# Altium schematic sheet currentSense.SchDoc
size A
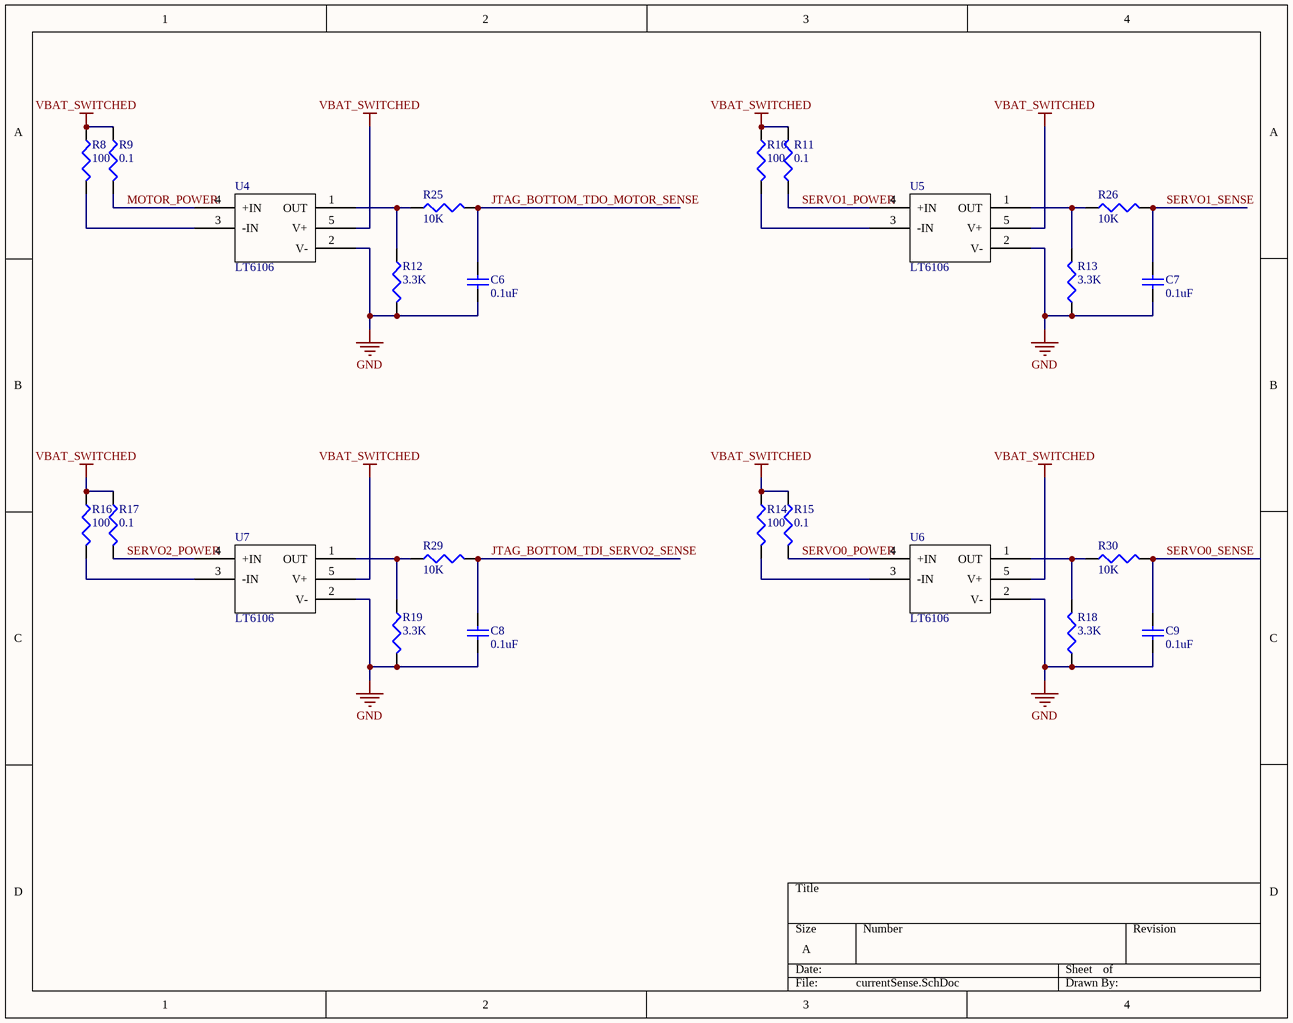
[diagram p0: currentSense.SchDoc]

## Parts
C6  value 0.1uF  [CAPC1005L]  (hidden comment: Cap Semi)
C7  value 0.1uF  [CAPC1005L]  (hidden comment: Cap Semi)
C8  value 0.1uF  [CAPC1005L]  (hidden comment: Cap Semi)
C9  value 0.1uF  [CAPC1005L]  (hidden comment: Cap Semi)
R8  value 100  [J1-0603]  (hidden comment: R_IN)
R9  value 0.1  [J1-0603]  (hidden comment: RLOAD)
R10  value 100  [J1-0603]  (hidden comment: R_IN)
R11  value 0.1  [J1-0603]  (hidden comment: RLOAD)
R12  value 3.3K  [J1-0603]  (hidden comment: R_OUT)
R13  value 3.3K  [J1-0603]  (hidden comment: R_OUT)
R14  value 100  [J1-0603]  (hidden comment: R_IN)
R15  value 0.1  [J1-0603]  (hidden comment: RLOAD)
R16  value 100  [J1-0603]  (hidden comment: R_IN)
R17  value 0.1  [J1-0603]  (hidden comment: RLOAD)
R18  value 3.3K  [J1-0603]  (hidden comment: R_OUT)
R19  value 3.3K  [J1-0603]  (hidden comment: R_OUT)
R25  value 10K  [J1-0603]  (hidden comment: LPF)
R26  value 10K  [J1-0603]  (hidden comment: LPF)
R29  value 10K  [J1-0603]  (hidden comment: LPF)
R30  value 10K  [J1-0603]  (hidden comment: LPF)
U4  LT6106  [TSOT-23-5_LT6106]
U5  LT6106  [TSOT-23-5_LT6106]
U6  LT6106  [TSOT-23-5_LT6106]
U7  LT6106  [TSOT-23-5_LT6106]

## Nets
GND: C6.1 C7.1 C8.1 C9.1 R12.2 R13.1 R18.1 R19.2 U4.2(V-) U5.2(V-) U6.2(V-) U7.2(V-)
VBAT_SWITCHED: R8.1 R9.1 R10.1 R11.2 R14.1 R15.1 R16.1 R17.1 U4.5(V+) U5.5(V+) U6.5(V+) U7.5(V+)
JTAG_BOTTOM_TDI_SERVO2_SENSE: C8.2 R29.2
JTAG_BOTTOM_TDO_MOTOR_SENSE: C6.2 R25.2
MOTOR_POWER: R9.2 U4.4(+IN)
SERVO0_POWER: R15.2 U6.4(+IN)
SERVO0_SENSE: C9.2 R30.2
SERVO1_POWER: R11.1 U5.4(+IN)
SERVO1_SENSE: C7.2 R26.2
SERVO2_POWER: R17.2 U7.4(+IN)
NetR8_2: R8.2 U4.3(-IN)
NetR10_2: R10.2 U5.3(-IN)
NetR12_1: R12.1 R25.1 U4.1(OUT)
NetR13_2: R13.2 R26.1 U5.1(OUT)
NetR14_2: R14.2 U6.3(-IN)
NetR16_2: R16.2 U7.3(-IN)
NetR18_2: R18.2 R30.1 U6.1(OUT)
NetR19_1: R19.1 R29.1 U7.1(OUT)

## Library data of the parts
C6-C9 = Cap Semi: Capacitor (Semiconductor SIM Model); Published: 8-Jun-2000; LatestRevisionDate: 29-May-2009; LatestRevisionNote: IPC-7351 Footprint Added.; PackageReference: C1206; Publisher: Altium Limited; PackageDescription: Chip Capacitor
R8-R19 R25 R26 R29 R30 = Res3: Resistor; Published: 8-Jun-2000; LatestRevisionDate: 29-May-2009; LatestRevisionNote: IPC-7351 Footprint Added.; PackageReference: J1-0603; Publisher: Altium Limited; PackageDescription: Chip Resistor
U4-U7 = LT6106: Current Sense Amplifier